# Altium schematic sheet FPGA_7A35T_GTP.SchDoc: Sayma RTM
size 420 x 297 mm; Author: G.Kasprowicz; CompanyName: WUT ISE; DrawnBy: G.Kasprowicz; Organization: WUT ISE; Address1: PW ISE; Address2: Nowowiejska 15/19 00-665 Warsaw; Address3: gkasprow@gmail.com; DocumentNumber: 10; Revision: 1.0; SheetNumber: 10; SheetTotal: 18; ModifiedBy: -; CheckedDate: -; Title2: GTP transceivers & SATA; DivGrp: WUT ISE; Designer: G.Kasprowicz; ModifiedDate: -; ProjectName: Sensor Box
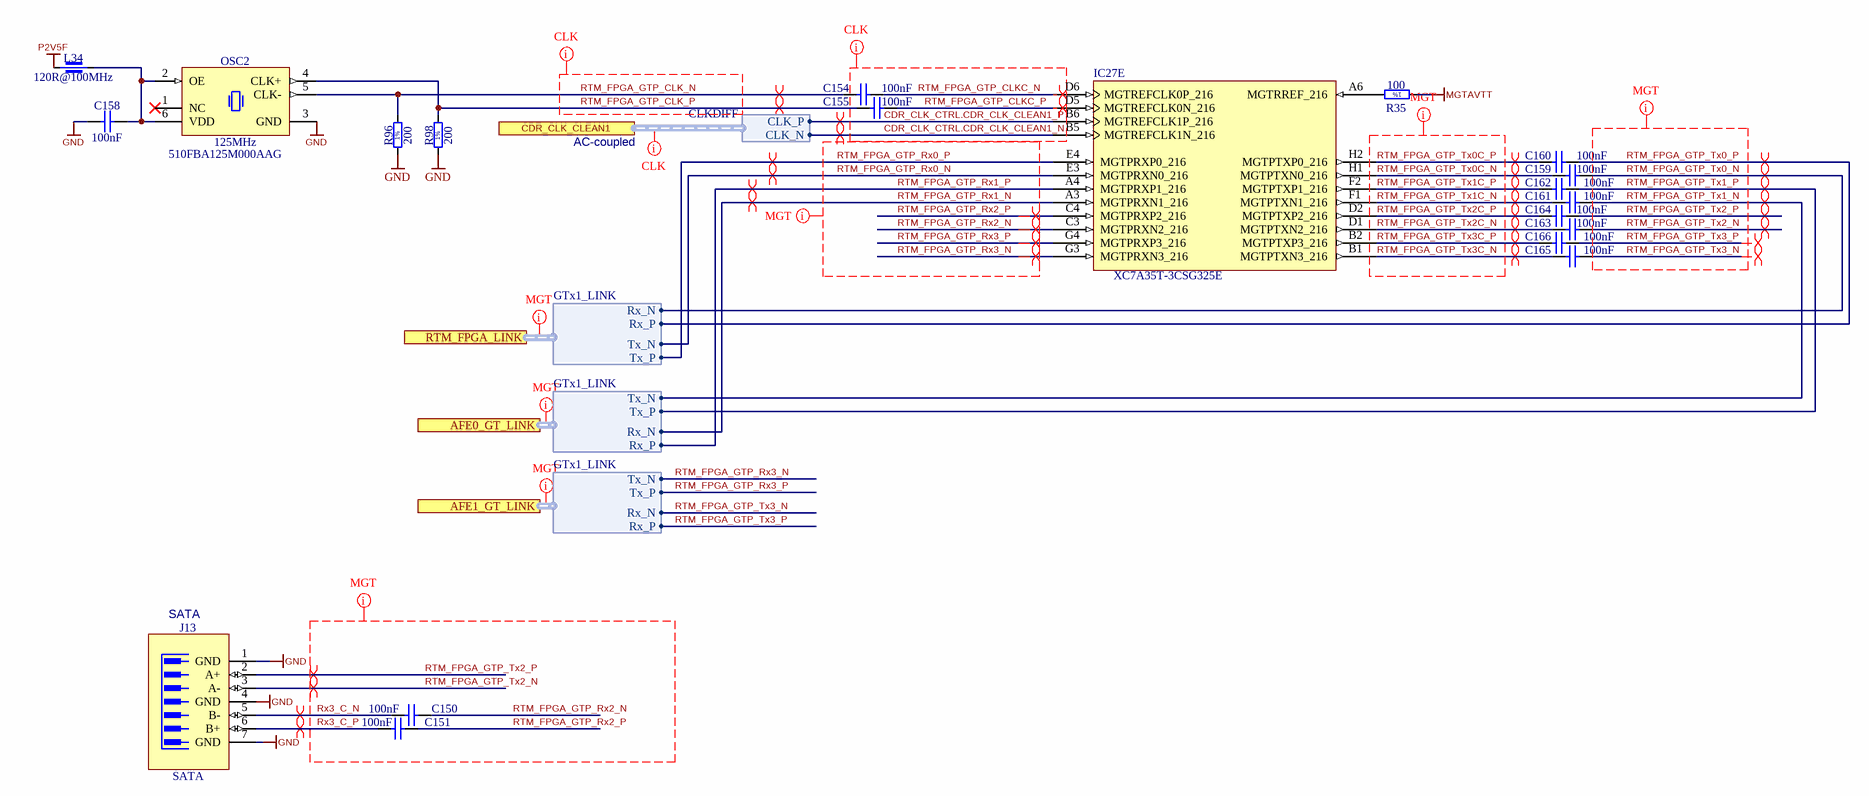
[diagram p0: FPGA_7A35T_GTP.SchDoc]

## Parts
C150  100nF  [CAPC0603X33N]
C151  100nF  [CAPC0603X33N]
C154  100nF  [CAPC0603X33N]
C155  100nF  [CAPC0603X33N]
C158  100nF  [CAPC0603X33N]
C159  100nF  [CAPC0603X33N]
C160  100nF  [CAPC0603X33N]
C161  100nF  [CAPC0603X33N]
C162  100nF  [CAPC0603X33N]
C163  100nF  [CAPC0603X33N]
C164  100nF  [CAPC0603X33N]
C165  100nF  [CAPC0603X33N]
C166  100nF  [CAPC0603X33N]
IC27  XC7A35T-3CSG325E  [CSG325]  (part E of 9)
J13  SATA  [MOLEX_67800-5005]
L34  120R@100MHz  [INDC1005X55N]
OSC2  125MHz  Manufacturer Part Number: 510FBA125M000AAG  [OSC_SILICON-LAB_SI510-6N(5X7)]
R35  100  [RESC1005X40N]
R96  200  [RESC1005X40N]
R98  200  [RESC1005X40N]

## Ports
AFE0_GT_LINK (harness GTx1_LINK), AFE1_GT_LINK (harness GTx1_LINK), CDR_CLK_CLEAN1 (harness CLKDIFF), RTM_FPGA_LINK (harness GTx1_LINK)

## Harnesses
CLKDIFF: CLK_N, CLK_P
GTx1_LINK: Rx_P, Rx_N, Tx_P, Tx_N

## Nets
GND: C158.1 J13.1(GND) J13.4(GND) J13.7(GND) OSC2.3(GND) R96.1 R98.1
MGTAVTT: R35.1
P2V5F: L34.2
CDR_CLK_CTRL.CDR_CLK_CLEAN1_N: IC27.B5(MGTREFCLK1N_216) ; port CDR_CLK_CLEAN1.CLK_N
CDR_CLK_CTRL.CDR_CLK_CLEAN1_P: IC27.B6(MGTREFCLK1P_216) ; port CDR_CLK_CLEAN1.CLK_P
RTM_FPGA_GTP_CLK_N: C154.1 OSC2.5(CLK-) R96.2
RTM_FPGA_GTP_CLK_P: C155.1 OSC2.4(CLK+) R98.2
RTM_FPGA_GTP_CLKC_N: C154.2 IC27.D6(MGTREFCLK0P_216)
RTM_FPGA_GTP_CLKC_P: C155.2 IC27.D5(MGTREFCLK0N_216)
RTM_FPGA_GTP_Rx0_N: IC27.E3(MGTPRXN0_216) ; port RTM_FPGA_LINK.Tx_N
RTM_FPGA_GTP_Rx0_P: IC27.E4(MGTPRXP0_216) ; port RTM_FPGA_LINK.Tx_P
RTM_FPGA_GTP_Rx1_N: IC27.A3(MGTPRXN1_216) ; port AFE0_GT_LINK.Rx_N
RTM_FPGA_GTP_Rx1_P: IC27.A4(MGTPRXP1_216) ; port AFE0_GT_LINK.Rx_P
RTM_FPGA_GTP_Rx2_N: C150.2 IC27.C3(MGTPRXN2_216)
RTM_FPGA_GTP_Rx2_P: C151.2 IC27.C4(MGTPRXP2_216)
RTM_FPGA_GTP_Rx3_N: IC27.G3(MGTPRXN3_216) ; port AFE1_GT_LINK.Tx_N
RTM_FPGA_GTP_Rx3_P: IC27.G4(MGTPRXP3_216) ; port AFE1_GT_LINK.Tx_P
RTM_FPGA_GTP_Tx0_N: C159.1 ; port RTM_FPGA_LINK.Rx_N
RTM_FPGA_GTP_Tx0_P: C160.1 ; port RTM_FPGA_LINK.Rx_P
RTM_FPGA_GTP_Tx0C_N: C159.2 IC27.H1(MGTPTXN0_216)
RTM_FPGA_GTP_Tx0C_P: C160.2 IC27.H2(MGTPTXP0_216)
RTM_FPGA_GTP_Tx1_N: C161.1 ; port AFE0_GT_LINK.Tx_N
RTM_FPGA_GTP_Tx1_P: C162.1 ; port AFE0_GT_LINK.Tx_P
RTM_FPGA_GTP_Tx1C_N: C161.2 IC27.F1(MGTPTXN1_216)
RTM_FPGA_GTP_Tx1C_P: C162.2 IC27.F2(MGTPTXP1_216)
RTM_FPGA_GTP_Tx2_N: C163.1 J13.3(A-)
RTM_FPGA_GTP_Tx2_P: C164.1 J13.2(A+)
RTM_FPGA_GTP_Tx2C_N: C163.2 IC27.D1(MGTPTXN2_216)
RTM_FPGA_GTP_Tx2C_P: C164.2 IC27.D2(MGTPTXP2_216)
RTM_FPGA_GTP_Tx3_N: C165.1 ; port AFE1_GT_LINK.Rx_N
RTM_FPGA_GTP_Tx3_P: C166.1 ; port AFE1_GT_LINK.Rx_P
RTM_FPGA_GTP_Tx3C_N: C165.2 IC27.B1(MGTPTXN3_216)
RTM_FPGA_GTP_Tx3C_P: C166.2 IC27.B2(MGTPTXP3_216)
Rx3_C_N: C150.1 J13.5(B-)
Rx3_C_P: C151.1 J13.6(B+)
NetC158_2: C158.2 L34.1 OSC2.2(OE) OSC2.6(VDD)
NetIC27_A6: IC27.A6(MGTRREF_216) R35.2

Not connected (* = marked no-connect by the designer): OSC2 1(NC)*

## Layout directives
net class CLK: (no net found under the mark), CDR_CLK_CTRL.CDR_CLK_CLEAN1_N, CDR_CLK_CTRL.CDR_CLK_CLEAN1_P, RTM_FPGA_GTP_CLK_N, RTM_FPGA_GTP_CLK_P, RTM_FPGA_GTP_CLKC_N, RTM_FPGA_GTP_CLKC_P
net class MGT: (no net found under the mark), RTM_FPGA_GTP_Rx0_N, RTM_FPGA_GTP_Rx0_P, RTM_FPGA_GTP_Rx1_N, RTM_FPGA_GTP_Rx1_P, RTM_FPGA_GTP_Rx2_N, RTM_FPGA_GTP_Rx2_P, RTM_FPGA_GTP_Rx3_N, RTM_FPGA_GTP_Rx3_P, RTM_FPGA_GTP_Tx0_N, RTM_FPGA_GTP_Tx0_P, RTM_FPGA_GTP_Tx0C_N, RTM_FPGA_GTP_Tx0C_P, RTM_FPGA_GTP_Tx1_N, RTM_FPGA_GTP_Tx1_P, RTM_FPGA_GTP_Tx1C_N, RTM_FPGA_GTP_Tx1C_P, RTM_FPGA_GTP_Tx2_N, RTM_FPGA_GTP_Tx2_P, RTM_FPGA_GTP_Tx2C_N, RTM_FPGA_GTP_Tx2C_P, RTM_FPGA_GTP_Tx3_N, RTM_FPGA_GTP_Tx3_P, RTM_FPGA_GTP_Tx3C_N, RTM_FPGA_GTP_Tx3C_P, Rx3_C_N, Rx3_C_P
differential pair: CDR_CLK_CTRL.CDR_CLK_CLEAN1_N, CDR_CLK_CTRL.CDR_CLK_CLEAN1_P, RTM_FPGA_GTP_CLK_N, RTM_FPGA_GTP_CLK_P, RTM_FPGA_GTP_CLKC_N, RTM_FPGA_GTP_CLKC_P, RTM_FPGA_GTP_Rx0_N, RTM_FPGA_GTP_Rx0_P, RTM_FPGA_GTP_Rx1_N, RTM_FPGA_GTP_Rx1_P, RTM_FPGA_GTP_Rx2_N, RTM_FPGA_GTP_Rx2_P, RTM_FPGA_GTP_Rx3_N, RTM_FPGA_GTP_Rx3_P, RTM_FPGA_GTP_Tx0_N, RTM_FPGA_GTP_Tx0_P, RTM_FPGA_GTP_Tx0C_N, RTM_FPGA_GTP_Tx0C_P, RTM_FPGA_GTP_Tx1_N, RTM_FPGA_GTP_Tx1_P, RTM_FPGA_GTP_Tx1C_N, RTM_FPGA_GTP_Tx1C_P, RTM_FPGA_GTP_Tx2_N, RTM_FPGA_GTP_Tx2_P, RTM_FPGA_GTP_Tx2C_N, RTM_FPGA_GTP_Tx2C_P, RTM_FPGA_GTP_Tx3_N, RTM_FPGA_GTP_Tx3_P, RTM_FPGA_GTP_Tx3C_N, RTM_FPGA_GTP_Tx3C_P, Rx3_C_N, Rx3_C_P

## Notes on the sheet
- AC-coupled
- SATA
- Project/Equipment
- Document
- Designer
- Drawn by
- Check.by
- Copyright WUT ISE 2018.
  This documentation describes Open Hardware and is licensed under the CERN OHL v.1.1. You may redistribute and modify this documentation under the terms of the CERN OHL v.1.1. (http://ohwr.org/CERNOHL). This documentation is distributed WITHOUT ANY EXPRESS OR IMPLIED WARRANTY, INCLUDING OF MERCHANTABILITY, SATISFACTORY QUALITY AND FITNESS FOR A PARTICULAR PURPOSE. Please see the CERN OHL v.1.1 for applicable conditions.
- Contact
- File
- Last Mod.
- Print Date
- Sheet
- Size
- A3
- of
- Rev
- (in symbol R0402_100R_1%_0.0625W_100PPM) 1%
- (in symbol R0402_200R_1%_0.0625W_100PPM) 1%

## Library data of the parts
C150 C151 C154 C155 C158-C166 = CC0201_100NF_6.3V_10%_X5R: Non-polarised capacitor; Manufacturer: GENERIC; Manufacturer1 Part Number: 02016D104KAT2A; Part Description: SMD Multilayer Chip Ceramic Capacitor; TC: X5R; Tolerance: ±10%; Voltage: 6.3V; Case: 0201; Manufacturer Part Number: CC0201_100NF_6.3V_10%_X5R; Manufacturer1 Example: AVX; Part Number: CC0201_100NF_6.3V_10%_X5R; Pin Count: 2; SMD: Yes; Status: Not Recommended; Value: 100nF; Component Kind: Standard; Component Type: Standard; Mounted: Yes; Socket: No; Sense: No; Manufacturer1 ComponentHeight: 0.33mm; HelpURL: \\cern.ch\dfs\Applications\Altium\Datasheets\CC0201_X5R_AVX.pdf; Author: CERN DEM JLC; CreateDate: 03.12.2007; LatestRevisionDate: 03.12.2007
IC27 = CMP-0383-00015-1: Artix-7 FPGA, 150 User I/Os, 4 GTP, 324-Ball BGA, Speed Grade 3, Extended Grade, Pb-Free; Manufacturer: Xilinx; CMTs: 5; Available User I/O: 150; GTP: 4; Speed Grades: 3; Total Block RAM: 1800 Kb; Logic Cells: 33280; ComponentLink3URL: http://www.xilinx.com/support/documentation/user_guides/ug475_7Series_Pkg_Pinout.pdf; ComponentLink3Description: Pinout; Operating Temperature Range: Extended; PackageReference: CSG-325; PackageDescription: 324-Ball Wire-Bond Chip-Scale BGA, Body 15 x 15 mm, Pitch 0.8 mm; ComponentLink4URL: http://www.xilinx.com/support/documentation/user_guides/ug475_7Series_Pkg_Pinout.pdf; ComponentLink1Description: Manufacturer URL; ComponentLink2Description: Datasheet; DatasheetVersion: Rev. 1.15; PartNumber: XC7A35T-3CSG325E; Mounting Technology: Surface Mount; ComponentLink1URL: http://www.xilinx.com/; PackageVersion: Rev. 1.11; ComponentLink2URL: http://www.xilinx.com/support/documentation/data_sheets/ds180_7Series_Overview.pdf; Maximum Distributed RAM: 400 Kb; ComponentLink4Description: Package Specification
J13 = MOLEX_67800-5005: 7 Pin SATA Receptacle; Manufacturer: MOLEX; Part Description: 1.27mm Pitch, 7 Contacts, Serial ATA High Speed Header, Straight with Locking Latch; PressFit: No; Manufacturer Part Number: 67800-5005; Part Number: MOLEX_67800-5005; Component Kind: Standard; Component Type: Standard; Pin Count: 7; Family: SATA; Mounted: Yes; Socket: No; SMD: Yes; Sense: No; Status: None; ComponentHeight: 8.4mm; HelpURL: \\cern.ch\dfs\Applications\Altium\Datasheets\MOLEX_67800-5005.pdf; Author: CERN DEM MR; CreateDate: 01.12.2016; LatestRevisionDate: 01.12.2016
L34 = IND0402_MURATA_BLM15PX121SN1D: Manufacturer: MURATA; Part Description: SMD EMIFIL Chip Ferrite Bead; Power: 2A; Resistance: 0.055R; Tolerance: ±25%; Case: 0402; ComponentHeight: 0.55mm; Manufacturer Part Number: BLM15PX121SN1D; Part Number: IND0402_MURATA_BLM15PX121SN1D; Pin Count: 2; SMD: Yes; Value: 120R@100MHz; Component Kind: Standard; Component Type: Standard; Status: None; Mounted: Yes; Socket: No; Sense: No; HelpURL: \\cern.ch\dfs\Applications\Altium\Datasheets\IND0402_MURATA_BLM15PX.pdf; Author: CERN DEM JMW; CreateDate: 19.02.2014; LatestRevisionDate: 25.10.2018
OSC2 = OSC_125MHZ_SILICON-LAB_510FBA125M000AAG: Crystal Oscillator 6 pins, Si510 (LVDS/LVPECL/HCSL/Dual CMOS); Part Description: 2.5V ±25ppm LVDS Crystal Oscillator (XO), Si510 Series; Manufacturer: SILICON LABS; PressFit: No; Bonding: No; Part Number: OSC_125MHZ_SILICON-LAB_510FBA125M000AAG; Component Kind: Standard; Component Type: Standard; PackageDescription: Oscillator Si510 Series, 6 pins, 5x7mm; Value: 125MHz; Pin Count: 6; Mounted: Yes; Socket: No; SMD: Yes; Sense: No; ComponentHeight: 1.8mm; HelpURL: \\cern.ch\dfs\Applications\Altium\Datasheets\OSC_SILICON-LAB_SI510.pdf; Author: CERN DEM JMW; CreateDate: 10.08.2015; LatestRevisionDate: 26.11.2018
R35 = R0402_100R_1%_0.0625W_100PPM: Resistor - 1%; Manufacturer: GENERIC; Manufacturer1 Part Number: 232270671001L; Part Description: General Purpose Thick Film Chip Resistor; TC: ±100ppm/°C; PressFit: No; Case: 0402; Manufacturer Part Number: R0402_100R_1%_0.0625W_100PPM; Manufacturer1 ComponentHeight: 0.4mm; Manufacturer1 Example: YAGEO PHYCOMP; Part Number: R0402_100R_1%_0.0625W_100PPM; Pin Count: 2; Power: 0.0625W; Sense: No; SMD: Yes; Status: Not Recommended; Tolerance: ±1%; Value: 100; Component Kind: Standard; Component Type: Standard; Mounted: Yes; Socket: No; HelpURL: \\cern.ch\dfs\Applications\Altium\Datasheets\R0402_Phycomp_RC0402.pdf; Author: CERN DEM JLC; CreateDate: 03.12.2007; LatestRevisionDate: 17.10.2012
R96 R98 = R0402_200R_1%_0.0625W_100PPM: Resistor - 1%; Manufacturer: GENERIC; Manufacturer1 Part Number: 232270672001L; Part Description: General Purpose Thick Film Chip Resistor; TC: ±100ppm/°C; PressFit: No; Case: 0402; Manufacturer Part Number: R0402_200R_1%_0.0625W_100PPM; Manufacturer1 ComponentHeight: 0.4mm; Manufacturer1 Example: YAGEO PHYCOMP; Part Number: R0402_200R_1%_0.0625W_100PPM; Pin Count: 2; Power: 0.0625W; Sense: No; SMD: Yes; Status: Not Recommended; Tolerance: ±1%; Value: 200; Component Kind: Standard; Component Type: Standard; Mounted: Yes; Socket: No; HelpURL: \\cern.ch\dfs\Applications\Altium\Datasheets\R0402_Phycomp_RC0402.pdf; Author: CERN DEM JLC; CreateDate: 03.12.2007; LatestRevisionDate: 17.10.2012